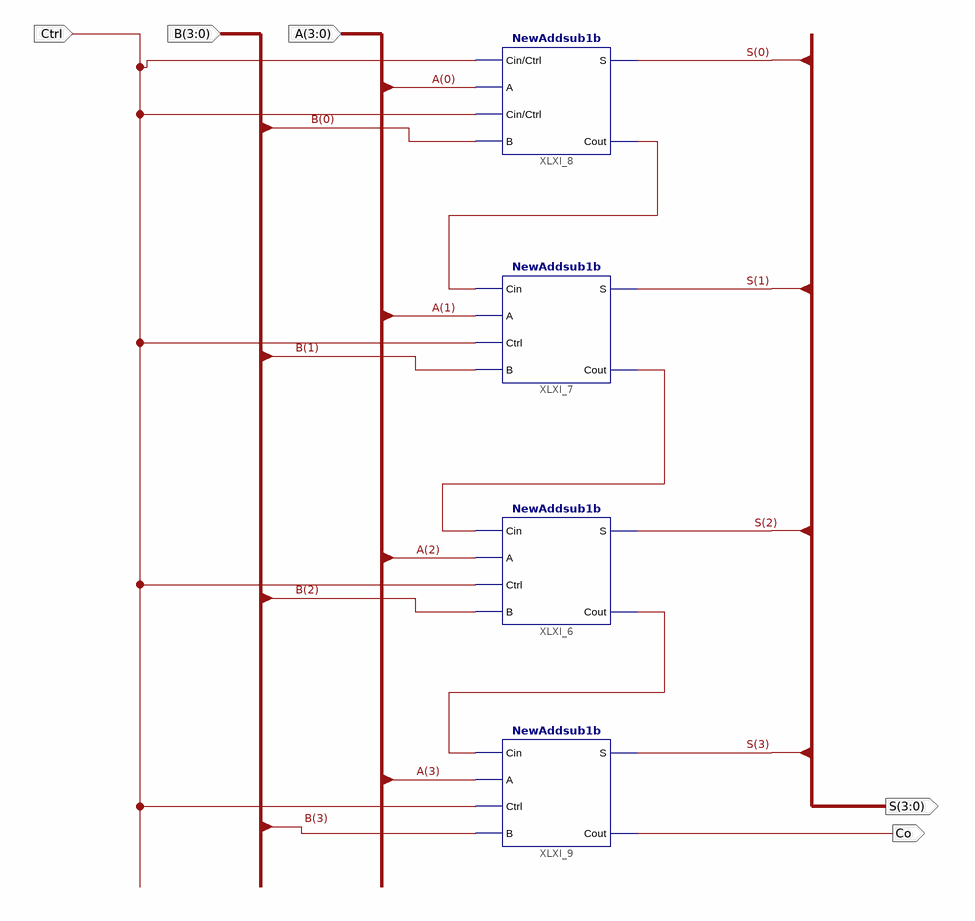
[diagram p0: schematic sheet 1]
// Xilinx ISE schematic Addsub4b.sch (kintex7) as structural Verilog: 4 symbols, 5 ports
module Addsub4b (
  input  [3:0] A,
  input  [3:0] B,
  input  Ctrl,
  output Co,
  output [3:0] S
);

  wire XLXN_5, XLXN_6, XLXN_7;

  NewAddsub1b XLXI_6 (.Cin(XLXN_5), .A(A[2]), .Ctrl(Ctrl), .B(B[2]), .S(S[2]), .Cout(XLXN_6));
  NewAddsub1b XLXI_7 (.Cin(XLXN_7), .A(A[1]), .Ctrl(Ctrl), .B(B[1]), .S(S[1]), .Cout(XLXN_5));
  NewAddsub1b XLXI_8 (.Cin(Ctrl), .A(A[0]), .Ctrl(Ctrl), .B(B[0]), .S(S[0]), .Cout(XLXN_7));
  NewAddsub1b XLXI_9 (.Cin(XLXN_6), .A(A[3]), .Ctrl(Ctrl), .B(B[3]), .S(S[3]), .Cout(Co));
endmodule
